# Altium project IOBoard2020.PrjPcb (part 1 of 3)
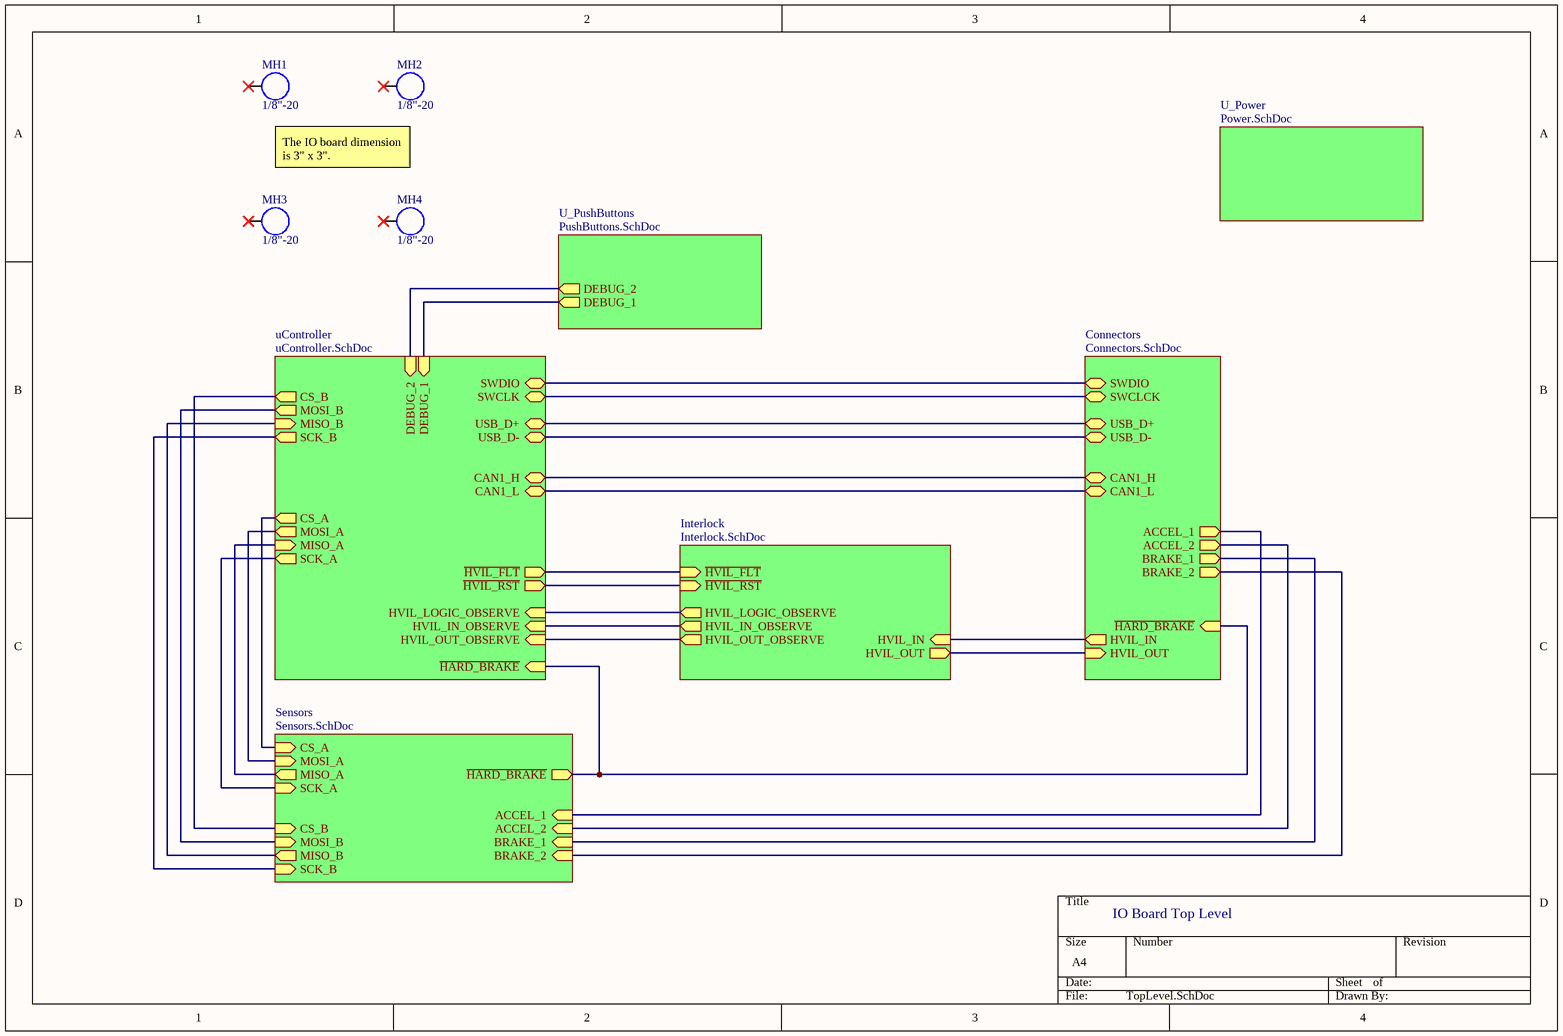
[diagram p0: TopLevel.SchDoc]
7 sheets, 153 parts. Net scope: hierarchical (ports join the sheet entries above them; power ports are global).
Board file: IOBoard2020.PcbDoc
Sheets:
  TopLevel.SchDoc
    uController = uController.SchDoc
    Connectors = Connectors.SchDoc
    Interlock = Interlock.SchDoc
    Sensors = Sensors.SchDoc
    U_Power = Power.SchDoc
    U_PushButtons = PushButtons.SchDoc

## Sheet TopLevel.SchDoc
size A4

### Parts
MH1  1/8"-20  [MOUNTING_HOLE]
MH2  1/8"-20  [MOUNTING_HOLE]
MH3  1/8"-20  [MOUNTING_HOLE]
MH4  1/8"-20  [MOUNTING_HOLE]

### Sub-sheets
Connectors = Connectors.SchDoc: CAN1_L (bidir), SWCLCK (bidir), SWDIO (bidir), USB_D+ (bidir), USB_D- (bidir), HVIL_IN (out), CAN1_H (bidir), HVIL_OUT (in), ACCEL_1 (out), BRAKE_1 (out), BRAKE_2 (out), ACCEL_2 (out), ~{HARD_BRAKE} (in)
Interlock = Interlock.SchDoc: HVIL_OUT_OBSERVE (out), HVIL_OUT (out), ~{HVIL_RST} (in), HVIL_IN (in), HVIL_IN_OBSERVE (out), ~{HVIL_FLT} (in), HVIL_LOGIC_OBSERVE (out)
Sensors = Sensors.SchDoc: ACCEL_2 (in), BRAKE_1 (in), BRAKE_2 (in), ACCEL_1 (in), ~{HARD_BRAKE} (out), MISO_A (out), MOSI_A (in), CS_A (in), SCK_A (in), MISO_B (out), MOSI_B (in), CS_B (in), SCK_B (in)
U_Power = Power.SchDoc: no entries
U_PushButtons = PushButtons.SchDoc: DEBUG_2 (out), DEBUG_1 (out)
uController = uController.SchDoc: HVIL_OUT_OBSERVE (in), HVIL_LOGIC_OBSERVE (in), HVIL_IN_OBSERVE (in), USB_D- (bidir), SWDIO (bidir), SWCLK (bidir), ~{HVIL_RST} (out), USB_D+ (bidir), ~{HVIL_FLT} (out), CAN1_H (bidir), CAN1_L (bidir), CS_B (out), MOSI_B (out), ~{HARD_BRAKE} (in), CS_A (out), MISO_A (in), SCK_A (out), MOSI_A (out), MISO_B (in), SCK_B (out), DEBUG_1 (in), DEBUG_2 (in)

### Nets
ACCEL_1: sheet Connectors/ACCEL_1, sheet Sensors/ACCEL_1
ACCEL_2: sheet Connectors/ACCEL_2, sheet Sensors/ACCEL_2
BRAKE_1: sheet Connectors/BRAKE_1, sheet Sensors/BRAKE_1
BRAKE_2: sheet Connectors/BRAKE_2, sheet Sensors/BRAKE_2
CAN1_N: sheet uController/CAN1_L, sheet Connectors/CAN1_L
CAN1_P: sheet uController/CAN1_H, sheet Connectors/CAN1_H
NetC42_2: sheet uController/DEBUG_1, sheet U_PushButtons/DEBUG_1
NetC43_2: sheet uController/DEBUG_2, sheet U_PushButtons/DEBUG_2
NetIC1_26: sheet uController/SCK_A, sheet Sensors/SCK_A
NetIC1_27: sheet uController/MISO_A, sheet Sensors/MISO_A
NetIC1_28: sheet uController/MOSI_A, sheet Sensors/MOSI_A
NetIC1_29: sheet uController/CS_A, sheet Sensors/CS_A
NetIC1_47: sheet uController/SCK_B, sheet Sensors/SCK_B
NetIC1_48: sheet uController/MISO_B, sheet Sensors/MISO_B
NetIC1_49: sheet uController/MOSI_B, sheet Sensors/MOSI_B
NetIC1_50: sheet uController/CS_B, sheet Sensors/CS_B
NetIC1_72: sheet uController/~{HARD_BRAKE}, sheet Connectors/~{HARD_BRAKE}, sheet Sensors/~{HARD_BRAKE}
NetIC1_73: sheet uController/USB_D-, sheet Connectors/USB_D-
NetIC1_74: sheet uController/USB_D+, sheet Connectors/USB_D+
NetIC1_75: sheet uController/SWDIO, sheet Connectors/SWDIO
NetIC1_79: sheet uController/SWCLK, sheet Connectors/SWCLCK
NetIC1_92: sheet uController/HVIL_LOGIC_OBSERVE, sheet Interlock/HVIL_LOGIC_OBSERVE
NetIC1_93: sheet uController/HVIL_IN_OBSERVE, sheet Interlock/HVIL_IN_OBSERVE
NetIC1_94: sheet uController/HVIL_OUT_OBSERVE, sheet Interlock/HVIL_OUT_OBSERVE
NetIC1_95: sheet uController/~{HVIL_FLT}, sheet Interlock/~{HVIL_FLT}
NetIC1_96: sheet uController/~{HVIL_RST}, sheet Interlock/~{HVIL_RST}
NetJ5_1: sheet Connectors/HVIL_OUT, sheet Interlock/HVIL_OUT
NetJ5_2: sheet Connectors/HVIL_IN, sheet Interlock/HVIL_IN

Not connected (* = marked no-connect by the designer): MH1 1*; MH2 1*; MH3 1*; MH4 1*

### Notes on the sheet
- The IO board dimension is 3" x 3".
- IO Board Top Level

### Library data of the parts
MH1-MH4 = Mounting Hole: Mounting Hole for 1/8"-20 Thread Size, 1-1/8" Long Black-Oxide Alloy Steel Socket Head Screw; Screw Specs: https://www.mcmaster.com/91251A560/

## Sheet uController.SchDoc
size A3
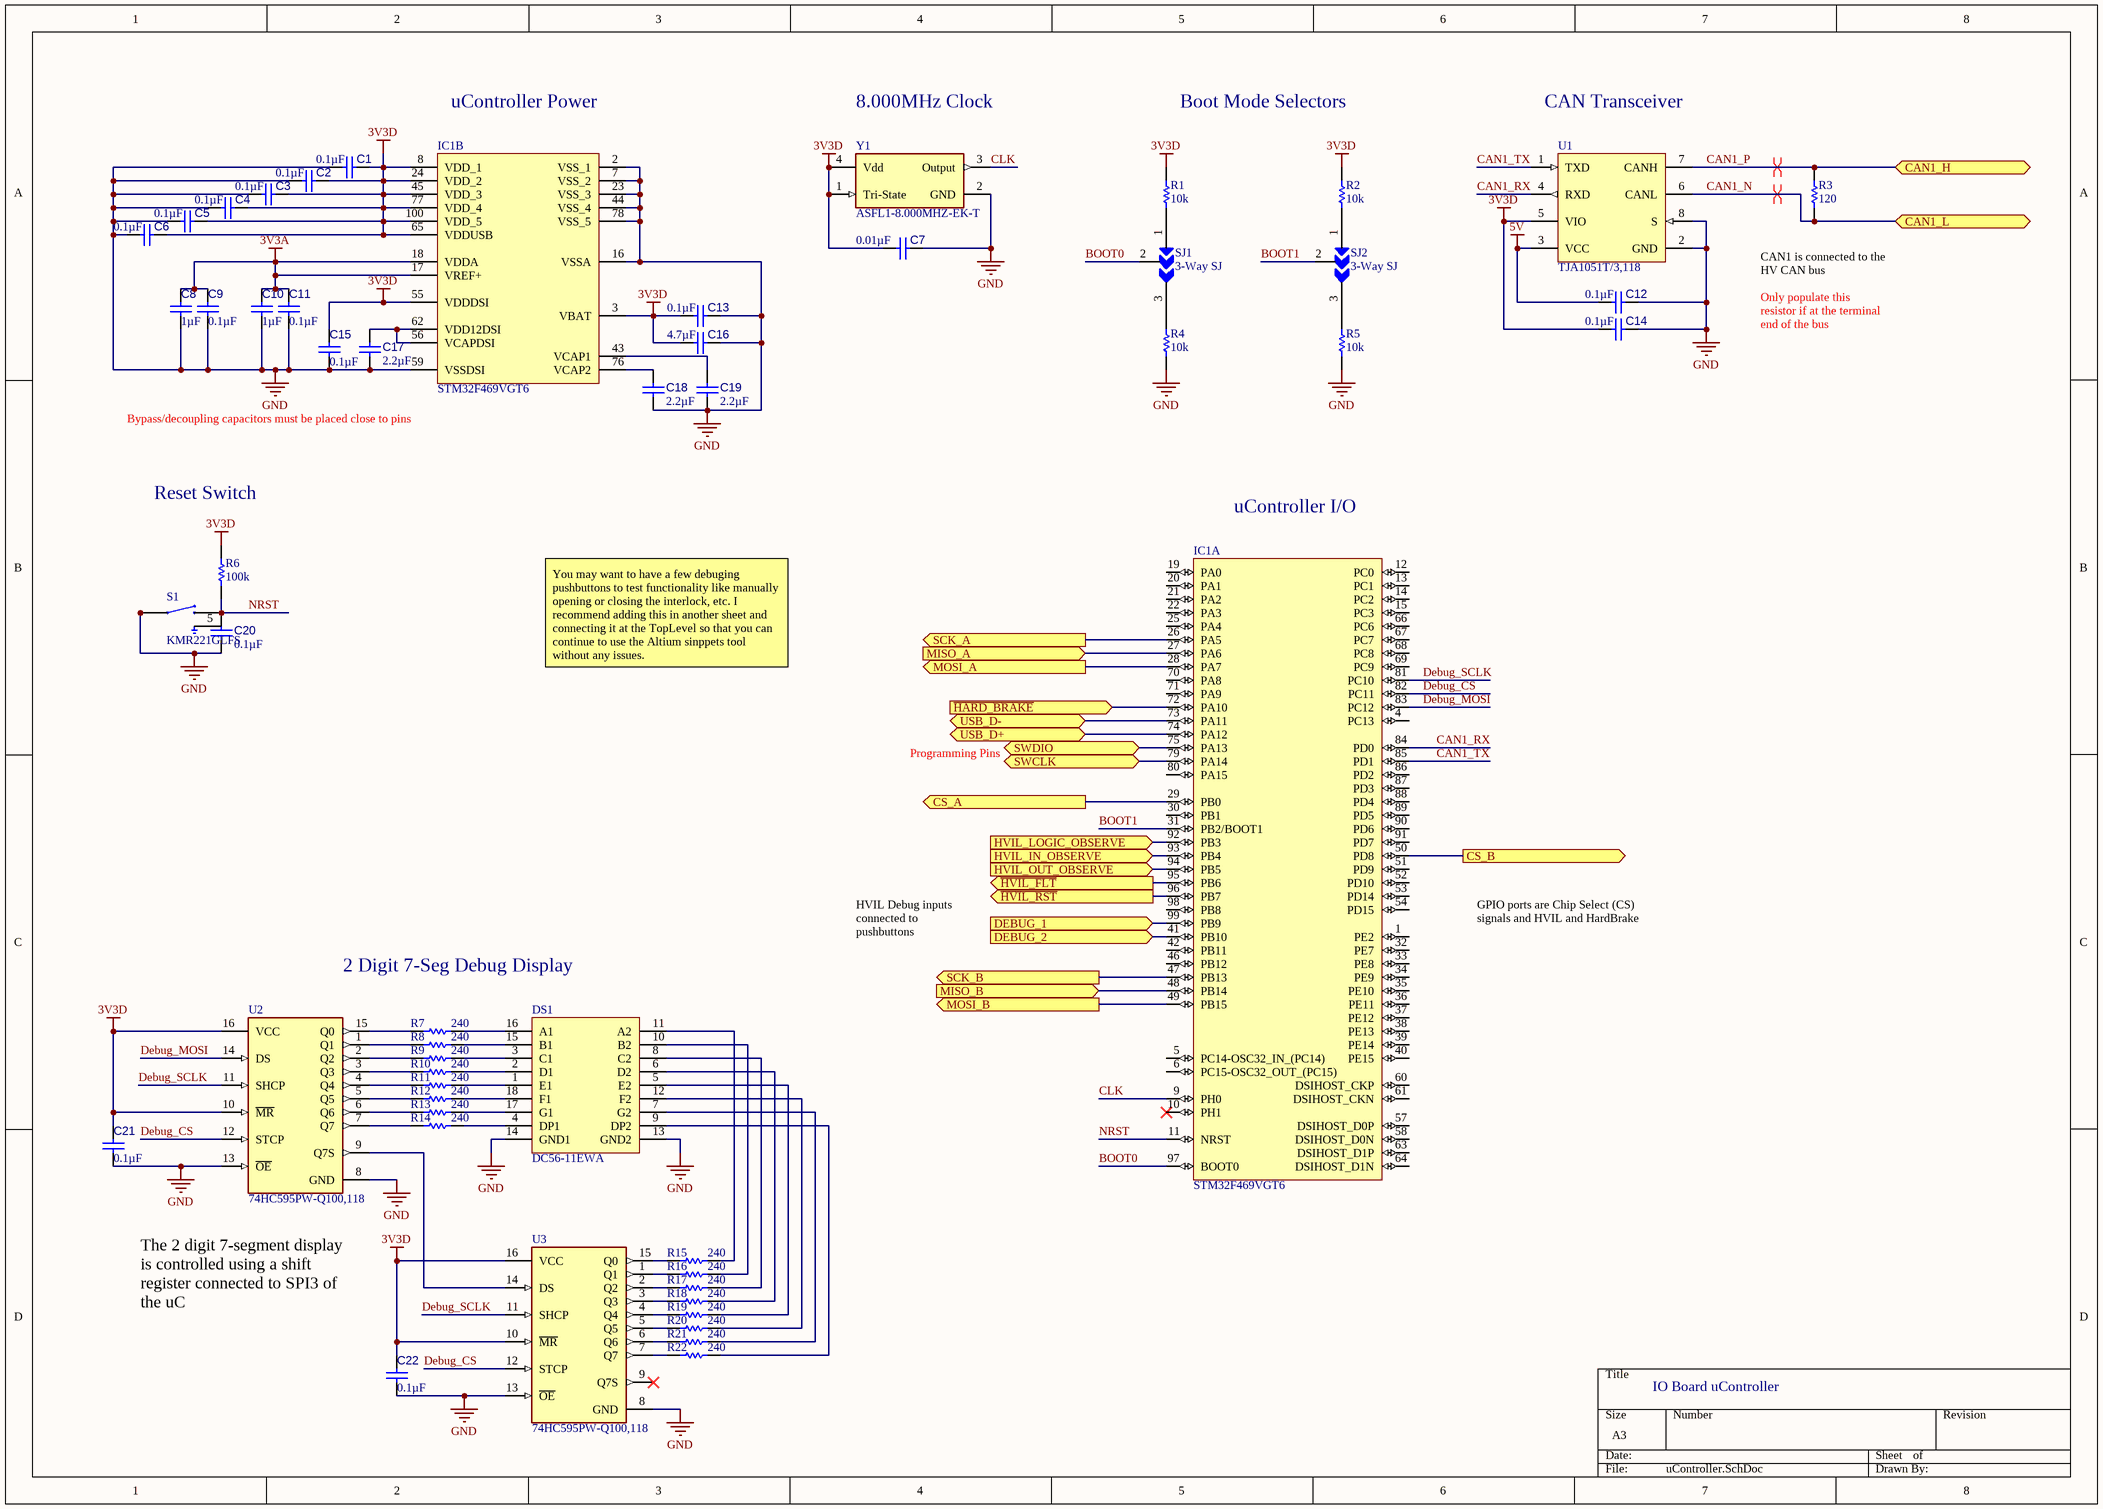
[diagram p1: uController.SchDoc]

### Parts
C1  0.1µF  [CAPC2013X145X50ML20T25]
C2  0.1µF  [CAPC2013X145X50ML20T25]
C3  0.1µF  [CAPC2013X145X50ML20T25]
C4  0.1µF  [CAPC2013X145X50ML20T25]
C5  0.1µF  [CAPC2013X145X50ML20T25]
C6  0.1µF  [CAPC2013X145X50ML20T25]
C7  0.01µF  [CAPC2013X145X50ML20T25]
C8  1µF  [CAPC2013X145X50ML20T25]
C9  0.1µF  [CAPC2013X145X50ML20T25]
C10  1µF  [CAPC2013X145X50ML20T25]
C11  0.1µF  [CAPC2013X145X50ML20T25]
C12  0.1µF  [CAPC2013X145X50ML20T25]
C13  0.1µF  [CAPC2013X145X50ML20T25]
C14  0.1µF  [CAPC2013X145X50ML20T25]
C15  0.1µF  [CAPC2013X145X50ML20T25]
C16  4.7µF  [CAPC2013X145X50ML20T25]
C17  2.2µF  [CAPC2013X145X50ML20T25]
C18  2.2µF  [CAPC2013X145X50ML20T25]
C19  2.2µF  [CAPC2013X145X50ML20T25]
C20  0.1µF  [CAPC2013X145X50ML20T25]
C21  0.1µF  [CAPC2013X145X50ML20T25]
C22  0.1µF  [CAPC2013X145X50ML20T25]
DS1  DC56-11EWA  [DIPS1524W75P254L2500H825Q18N]
IC1  STM32F469VGT6  [QFP50P1600X1600X160-100N]  (parts A,B of 2)
R1  10k  [RESC2013X50X35ML15T15]
R2  10k  [RESC2013X50X35ML15T15]
R3  120  [RESC2013X50X35ML15T15]
R4  10k  [RESC2013X50X35ML15T15]
R5  10k  [RESC2013X50X35ML15T15]
R6  100k  [RESC2013X50X35ML15T15]
R7  240  [RESC2013X50X35ML15T15]
R8  240  [RESC2013X50X35ML15T15]
R9  240  [RESC2013X50X35ML15T15]
R10  240  [RESC2013X50X35ML15T15]
R11  240  [RESC2013X50X35ML15T15]
R12  240  [RESC2013X50X35ML15T15]
R13  240  [RESC2013X50X35ML15T15]
R14  240  [RESC2013X50X35ML15T15]
R15  240  [RESC2013X50X35ML15T15]
R16  240  [RESC2013X50X35ML15T15]
R17  240  [RESC2013X50X35ML15T15]
R18  240  [RESC2013X50X35ML15T15]
R19  240  [RESC2013X50X35ML15T15]
R20  240  [RESC2013X50X35ML15T15]
R21  240  [RESC2013X50X35ML15T15]
R22  240  [RESC2013X50X35ML15T15]
S1  KMR221GLFS  [SW_KMR221GLFS]
SJ1  3-Way SJ  [3-Way SJ]
SJ2  3-Way SJ  [3-Way SJ]
U1  TJA1051T/3,118  [NXP-SOIC-8_L]
U2  74HC595PW-Q100,118  [FP-SOT403-1-MFG]
U3  74HC595PW-Q100,118  [FP-SOT403-1-MFG]
Y1  ASFL1-8.000MHZ-EK-T  [FP-ASFL1-MFG]

### Ports
CAN1_H (bidir), CAN1_L (bidir), CS_A (out), CS_B (out), DEBUG_1 (in), DEBUG_2 (in), HVIL_IN_OBSERVE (in), HVIL_LOGIC_OBSERVE (in), HVIL_OUT_OBSERVE (in), MISO_A (in), MISO_B (in), MOSI_A (out), MOSI_B (out), SCK_A (out), SCK_B (out), SWCLK (bidir), SWDIO (bidir), USB_D+ (bidir), USB_D- (bidir), ~{HARD_BRAKE} (in), ~{HVIL_FLT} (out), ~{HVIL_RST} (out)

### Nets
3V3A: C8.2 C9.1 C10.2 C11.1 IC1.17(VREF+) IC1.18(VDDA)
3V3D: C1.2 C2.2 C3.2 C4.2 C5.2 C6.2 C7.1 C13.1 C14.1 C15.1 C16.1 C21.1 C22.1 IC1.3(VBAT) IC1.8(VDD_1) IC1.24(VDD_2) IC1.45(VDD_3) IC1.55(VDDDSI) IC1.65(VDDUSB) IC1.77(VDD_4) IC1.100(VDD_5) R1.2 R2.2 R6.2 U1.5(VIO) U2.10(~{MR}) U2.16(VCC) U3.10(~{MR}) U3.16(VCC) Y1.1(Tri-State) Y1.4(Vdd)
5V: C12.1 U1.3(VCC)
GND: C1.1 C2.1 C3.1 C4.1 C5.1 C6.1 C7.2 C8.1 C9.2 C10.1 C11.2 C12.2 C13.2 C14.2 C15.2 C16.2 C17.1 C18.1 C19.1 C20.1 C21.2 C22.2 DS1.13(GND2) DS1.14(GND1) IC1.2(VSS_1) IC1.7(VSS_2) IC1.16(VSSA) IC1.23(VSS_3) IC1.44(VSS_4) IC1.59(VSSDSI) IC1.78(VSS_5) R4.1 R5.1 S1.1 S1.4 U1.2(GND) U1.8(S) U2.8(GND) U2.13(~{OE}) U3.8(GND) U3.13(~{OE}) Y1.2(GND)
BOOT0: IC1.97(BOOT0) SJ1.2
BOOT1: IC1.31(PB2/BOOT1) SJ2.2
CAN1_N: R3.1 U1.6(CANL) ; port CAN1_L
CAN1_P: R3.2 U1.7(CANH) ; port CAN1_H
CAN1_RX: IC1.84(PD0) U1.4(RXD)
CAN1_TX: IC1.85(PD1) U1.1(TXD)
CLK: IC1.9(PH0) Y1.3(Output)
Debug_CS: IC1.82(PC11) U2.12(STCP) U3.12(STCP)
Debug_MOSI: IC1.83(PC12) U2.14(DS)
Debug_SCLK: IC1.81(PC10) U2.11(SHCP) U3.11(SHCP)
NRST: C20.2 IC1.11(NRST) R6.1 S1.2 S1.3
NetC17_2: C17.2 IC1.56(VCAPDSI) IC1.62(VDD12DSI)
NetC18_2: C18.2 IC1.76(VCAP2)
NetC19_2: C19.2 IC1.43(VCAP1)
NetC42_2: IC1.99(PB9) ; port DEBUG_1
NetC43_2: IC1.41(PB10) ; port DEBUG_2
NetDS1_1: DS1.1(E1) R11.1
NetDS1_2: DS1.2(D1) R10.1
NetDS1_3: DS1.3(C1) R9.1
NetDS1_4: DS1.4(DP1) R14.1
NetDS1_5: DS1.5(E2) R19.1
NetDS1_6: DS1.6(D2) R18.1
NetDS1_7: DS1.7(G2) R21.1
NetDS1_8: DS1.8(C2) R17.1
NetDS1_9: DS1.9(DP2) R22.1
NetDS1_10: DS1.10(B2) R16.1
NetDS1_11: DS1.11(A2) R15.1
NetDS1_12: DS1.12(F2) R20.1
NetDS1_15: DS1.15(B1) R8.1
NetDS1_16: DS1.16(A1) R7.1
NetDS1_17: DS1.17(G1) R13.1
NetDS1_18: DS1.18(F1) R12.1
NetIC1_26: IC1.26(PA5) ; port SCK_A
NetIC1_27: IC1.27(PA6) ; port MISO_A
NetIC1_28: IC1.28(PA7) ; port MOSI_A
NetIC1_29: IC1.29(PB0) ; port CS_A
NetIC1_47: IC1.47(PB13) ; port SCK_B
NetIC1_48: IC1.48(PB14) ; port MISO_B
NetIC1_49: IC1.49(PB15) ; port MOSI_B
NetIC1_50: IC1.50(PD8) ; port CS_B
NetIC1_72: IC1.72(PA10) ; port ~{HARD_BRAKE}
NetIC1_73: IC1.73(PA11) ; port USB_D-
NetIC1_74: IC1.74(PA12) ; port USB_D+
NetIC1_75: IC1.75(PA13) ; port SWDIO
NetIC1_79: IC1.79(PA14) ; port SWCLK
NetIC1_92: IC1.92(PB3) ; port HVIL_LOGIC_OBSERVE
NetIC1_93: IC1.93(PB4) ; port HVIL_IN_OBSERVE
NetIC1_94: IC1.94(PB5) ; port HVIL_OUT_OBSERVE
NetIC1_95: IC1.95(PB6) ; port ~{HVIL_FLT}
NetIC1_96: IC1.96(PB7) ; port ~{HVIL_RST}
NetR1_1: R1.1 SJ1.1
NetR2_1: R2.1 SJ2.1
NetR4_2: R4.2 SJ1.3
NetR5_2: R5.2 SJ2.3
NetR7_2: R7.2 U2.15(Q0)
NetR8_2: R8.2 U2.1(Q1)
NetR9_2: R9.2 U2.2(Q2)
NetR10_2: R10.2 U2.3(Q3)
NetR11_2: R11.2 U2.4(Q4)
NetR12_2: R12.2 U2.5(Q5)
NetR13_2: R13.2 U2.6(Q6)
NetR14_2: R14.2 U2.7(Q7)
NetR15_2: R15.2 U3.15(Q0)
NetR16_2: R16.2 U3.1(Q1)
NetR17_2: R17.2 U3.2(Q2)
NetR18_2: R18.2 U3.3(Q3)
NetR19_2: R19.2 U3.4(Q4)
NetR20_2: R20.2 U3.5(Q5)
NetR21_2: R21.2 U3.6(Q6)
NetR22_2: R22.2 U3.7(Q7)
NetU2_9: U2.9(Q7S) U3.14(DS)

Not connected (* = marked no-connect by the designer): IC1 1(PE2) 4(PC13) 5(PC14-OSC32_IN_(PC14)) 6(PC15-OSC32_OUT_(PC15)) 10(PH1)* 12(PC0) 13(PC1) 14(PC2) 15(PC3) 19(PA0) 20(PA1) 21(PA2) 22(PA3) 25(PA4) 30(PB1) 32(PE7) 33(PE8) 34(PE9) 35(PE10) 36(PE11) 37(PE12) 38(PE13) 39(PE14) 40(PE15) 42(PB11) 46(PB12) 51(PD9) 52(PD10) 53(PD14) 54(PD15) 57(DSIHOST_D0P) 58(DSIHOST_D0N) 60(DSIHOST_CKP) 61(DSIHOST_CKN) 63(DSIHOST_D1P) 64(DSIHOST_D1N) 66(PC6) 67(PC7) 68(PC8) 69(PC9) 70(PA8) 71(PA9) 80(PA15) 86(PD2) 87(PD3) 88(PD4) 89(PD5) 90(PD6) 91(PD7) 98(PB8); S1 5; U3 9(Q7S)*

### Layout directives
differential pair: CAN1_N, CAN1_P

### Notes on the sheet
- uController Power
- 8.000MHz Clock
- Boot Mode Selectors
- CAN Transceiver
- (near R3) CAN1 is connected to the HV CAN bus
- Only populate this resistor if at the terminal end of the bus
- Bypass/decoupling capacitors must be placed close to pins
- Reset Switch
- uController I/O
- You may want to have a few debuging pushbuttons to test functionality like manually opening or closing the interlock, etc. I recommend adding this in another sheet and connecting it at the TopLevel so that you can continue to use the Altium sinppets tool without any issues.
- Programming Pins
- 2 Digit 7-Seg Debug Display
- HVIL Debug inputs connected to pushbuttons
- GPIO ports are Chip Select (CS) signals and HVIL and HardBrake
- The 2 digit 7-segment display is controlled using a shift register connected to SPI3 of the uC
- IO Board uController

### Library data of the parts
C1-C6 C9 C11-C15 C20-C22 = CMP-001-00010-4: Chip Capacitor, 0.1 uF, +/-10%, 25 V, 0805 (2012 Metric); Manufacturer: KEMET; Manufacturer Part Number: C0805C104K3RACTU; Dielectric Material: Ceramic; Tolerance: 10%; Capacitance: 100nF; Dielectric: X7R; Voltage: 25V; Value: 0.1µF; Supplier 1: Digi-Key; Supplier Part Number 1: 399-1168-1-ND; RoHS: Yes; Category: Ceramic Capacitors; Stock 1: 417116; Pricing 1: 1=0.14000, 10=0.10000, 50=0.05660, 100=0.04680, 500=0.03284, 1000=0.02719 (USD); Mount: Surface Mount; Case/Package: 0805; Min Operating Temperature: -55°C; Max Operating Temperature: 125°C; Packaging: Tape and Reel; Termination: SMD/SMT; Length: 2mm; Height: 0.9mm; Depth: 1.25mm; Radiation Hardening: No; ComponentLink1URL: https://datasheet.ciiva.com/18193/getdatasheetpartid-385649-18193413.pdf?src-supplier=Verical; ComponentLink1Description: https://datasheet.ciiva.com/18193/getdatasheetpartid-385649-18193413.pdf?src-supplier=Verical; ComponentLink2URL: https://datasheet.ciiva.com/7842/kem-c1002-x7r-smd-7842536.pdf?src-supplier=Element14; ComponentLink2Description: https://datasheet.ciiva.com/7842/kem-c1002-x7r-smd-7842536.pdf?src-supplier=Element14; ComponentLink3URL: https://datasheet.ciiva.com/7842/kem-c1002-x7r-smd-7842538.pdf?src-supplier=Element14; ComponentLink3Description: https://datasheet.ciiva.com/7842/kem-c1002-x7r-smd-7842538.pdf?src-supplier=Element14
C7 = CMP-001-00010-4: Chip Capacitor, 0.01 uF, +/-10%, 25 V, 0805 (2012 Metric); Manufacturer: KEMET; Manufacturer Part Number: C0805C103K3RACTU; Dielectric Material: Ceramic; Capacitance: 10nF; Voltage Rating: 25V; Tolerance: 10%; Dielectric: X7R; Dissipation Factor: 3.5%; Value: 0.01µF; Supplier 1: Digi-Key; Supplier Part Number 1: 399-7994-1-ND; RoHS: Yes; Category: Ceramic Capacitors; Stock 1: 50651; Pricing 1: 1=0.15000, 10=0.11000, 50=0.06220, 100=0.05160, 500=0.03616, 1000=0.02994 (USD); Mount: Surface Mount; Case/Package: 0805; Case Code (Metric): 2012; Case Code (Imperial): 0805; Min Operating Temperature: -55°C; Max Operating Temperature: 125°C; Package Quantity: 1; Packaging: Tape and Reel; Voltage Rating (DC): 25V; Termination: SMD/SMT; Length: 2mm; Height: 0.78mm; Lead Pitch: 0.75mm; Width: 0.049inch; Thickness: 0.035inch; Depth: 1.25mm; Radiation Hardening: No; REACH SVHC: No SVHC; ComponentLink1URL: http://www.jameco.com/Jameco/Products/ProdDS/1637716.pdf?src-supplier=Jameco; ComponentLink1Description: http://www.jameco.com/Jameco/Products/ProdDS/1637716.pdf?src-supplier=Jameco; ComponentLink2URL: http://www.farnell.com/datasheets/2746089.pdf?src-supplier=Farnell; ComponentLink2Description: http://www.farnell.com/datasheets/2746089.pdf?src-supplier=Farnell; ComponentLink3URL: https://www.verical.com/server-webapp/html/getDatasheet?partID=697850&src-supplier=Verical; ComponentLink3Description: https://www.verical.com/server-webapp/html/getDatasheet?partID=697850&src-supplier=Verical; ComponentLink4URL: http://components.arrow.com/part/dataview/0323_00325063?src-supplier=Arrow+Europe; ComponentLink4Description: http://components.arrow.com/part/dataview/0323_00325063?src-supplier=Arrow+Europe; ComponentLink5URL: http://www.farnell.com/datasheets/2315422.pdf?src-supplier=Farnell; ComponentLink5Description: http://www.farnell.com/datasheets/2315422.pdf?src-supplier=Farnell; ComponentLink6URL: http://www.mouser.com/ds/2/212/KEM_C1002_X7R_SMD-1102033.pdf?src-supplier=Mouser; ComponentLink6Description: http://www.mouser.com/ds/2/212/KEM_C1002_X7R_SMD-1102033.pdf?src-supplier=Mouser; ComponentLink7URL: http://components.arrow.com/part/dataview/2091057S98063N7429?src-supplier=Arrow+Electronics; ComponentLink7Description: http://components.arrow.com/part/dataview/2091057S98063N7429?src-supplier=Arrow+Electronics; ComponentLink8URL: https://api.kemet.com/component-edge/download/datasheet/C0805C103K3RACTU.pdf?src-supplier=Digi-Key; ComponentLink8Description: https://api.kemet.com/component-edge/download/datasheet/C0805C103K3RACTU.pdf?src-supplier=Digi-Key; ComponentLink9URL: http://capacitoredge.kemet.com/capedge2/DataSheet?pn=C0805C103K3RACTU&src-supplier=Avnet; ComponentLink9Description: http://capacitoredge.kemet.com/capedge2/DataSheet?pn=C0805C103K3RACTU&src-supplier=Avnet; ComponentLink10URL: https://search.kemet.com/component-edge/download/datasheet/C0805C103K3RACTU.pdf?src-supplier=Digi-Key; ComponentLink10Description: https://search.kemet.com/component-edge/download/datasheet/C0805C103K3RACTU.pdf?src-supplier=Digi-Key; ComponentLink11URL: http://www.farnell.com/datasheets/2746089.pdf?src-supplier=Newark; ComponentLink11Description: http://www.farnell.com/datasheets/2746089.pdf?src-supplier=Newark; ComponentLink12URL: http://www.farnell.com/datasheets/2064982.pdf?src-supplier=Element14; ComponentLink12Description: http://www.farnell.com/datasheets/2064982.pdf?src-supplier=Element14
C8 C10 = CMP-001-00010-4: Chip Capacitor, 1 uF, +/-10%, 25 V, 0805 (2012 Metric); Manufacturer: KEMET; Manufacturer Part Number: C0805C105K3RACTU; Dielectric Material: Ceramic; Capacitance: 1uF; Tolerance: 10%; Dielectric: X7R; Voltage: 25V; Value: 1µF; Supplier 1: Digi-Key; Supplier Part Number 1: 399-8004-1-ND; RoHS: Yes; Category: Ceramic Capacitors; Stock 1: 360844; Pricing 1: 1=0.14000, 10=0.10100, 50=0.05720, 100=0.04740, 500=0.03322, 1000=0.02750 (USD); Mount: Surface Mount; Case/Package: 0805; Number of Pins: 2; Contact Plating: Tin,Matte; Case Code (Imperial): 0805; Case Code (Metric): 2012; Min Operating Temperature: -55°C; Max Operating Temperature: 125°C; Packaging: Tape and Reel; Termination: SMD/SMT; Package Quantity: 1; Voltage Rating: 25V; Voltage Rating (DC): 25V; Length: 2mm; Height: 1.25mm; Depth: 1.25mm; Width: 0.049inch; Thickness: 0.055inch; Radiation Hardening: No; REACH SVHC: No SVHC; ComponentLink1URL: https://datasheet.ciiva.com/6074/kem-c1002-x7r-smd-6074661.pdf?src-supplier=Farnell; ComponentLink1Description: https://datasheet.ciiva.com/6074/kem-c1002-x7r-smd-6074661.pdf?src-supplier=Farnell; ComponentLink2URL: https://datasheet.ciiva.com/28610/1918693-28610874.pdf?src-supplier=Element14; ComponentLink2Description: https://datasheet.ciiva.com/28610/1918693-28610874.pdf?src-supplier=Element14
C16 = CMP-001-00010-4: Chip Capacitor, 4.7 uF, +/-10%, 25 V, 0805 (2012 Metric); Manufacturer: KEMET; Manufacturer Part Number: C0805C475K3PACTU; Dielectric Material: Ceramic; Capacitance: 4.7uF; Tolerance: 10%; Dielectric: X5R; Voltage: 25V; Value: 4.7µF; Supplier 1: Digi-Key; Supplier Part Number 1: 399-5505-1-ND; RoHS: Yes; Category: Ceramic Capacitors; Stock 1: 643803; Pricing 1: 1=0.33000, 10=0.22700, 50=0.15880, 100=0.13610, 500=0.10210, 1000=0.08621 (USD); Mount: Surface Mount; Case/Package: 0805; Number of Pins: 2; Min Operating Temperature: -55°C; Max Operating Temperature: 85°C; Packaging: Tape and Reel; Termination: SMD/SMT; Voltage Rating (DC): 25V; Length: 2mm; Height: 1.25mm; Depth: 1.25mm; Radiation Hardening: No; Lead Free: Lead Free; ComponentLink1URL: https://datasheet.ciiva.com/22748/1918694-22748309.pdf?src-supplier=Element14; ComponentLink1Description: https://datasheet.ciiva.com/22748/1918694-22748309.pdf?src-supplier=Element14; ComponentLink2URL: https://datasheet.ciiva.com/7842/40889-7842614.pdf?src-supplier=Element14; ComponentLink2Description: https://datasheet.ciiva.com/7842/40889-7842614.pdf?src-supplier=Element14; ComponentLink3URL: https://datasheet.ciiva.com/18193/getdatasheetpartid-385757-18193895.pdf?src-supplier=Verical; ComponentLink3Description: https://datasheet.ciiva.com/18193/getdatasheetpartid-385757-18193895.pdf?src-supplier=Verical; ComponentLink4URL: https://datasheet.ciiva.com/18193/getdatasheetpartid-195812-18193898.pdf?src-supplier=Verical; ComponentLink4Description: https://datasheet.ciiva.com/18193/getdatasheetpartid-195812-18193898.pdf?src-supplier=Verical
C17-C19 = CMP-001-00010-4: Chip Capacitor, 2.2 uF, +/-10%, 25 V, 0805 (2012 Metric); Manufacturer: KEMET; Manufacturer Part Number: C0805C225K3RACTU; Dielectric Material: Ceramic; Capacitance: 2.2uF; Tolerance: 10%; Dielectric: X7R; Voltage Rating (DC): 25V; Value: 2.2µF; Supplier 1: Digi-Key; Supplier Part Number 1: 399-11941-1-ND; RoHS: Yes; Category: Ceramic Capacitors; Stock 1: 55952; Pricing 1: 1=0.28000, 10=0.19300, 50=0.11600, 100=0.09790, 500=0.06700, 1000=0.05928 (USD); Mount: Surface Mount; Case/Package: 0805; Case Code (Imperial): 0805; Case Code (Metric): 2012; Min Operating Temperature: -55°C; Max Operating Temperature: 125°C; Packaging: Cut Tape; Voltage: 25V; Termination: Solder; Dissipation Factor: 10%; Voltage Rating: 25V; Length: 0.079inch; Height: 1.25mm; Depth: 1.25mm; Width: 0.049inch; Thickness: 0.055inch; REACH SVHC: No SVHC; ComponentLink1URL: http://www.mouser.com/ds/2/212/KEM_C1002_X7R_SMD-1102033.pdf?src-supplier=Mouser; ComponentLink1Description: http://www.mouser.com/ds/2/212/KEM_C1002_X7R_SMD-1102033.pdf?src-supplier=Mouser; ComponentLink2URL: http://www.farnell.com/datasheets/2741187.pdf?src-supplier=Farnell; ComponentLink2Description: http://www.farnell.com/datasheets/2741187.pdf?src-supplier=Farnell; ComponentLink3URL: http://www.alliedelec.com/m/d/51f554c3dd800f51434b811e71a34895.pdf?src-supplier=Allied+Electronics; ComponentLink3Description: http://www.alliedelec.com/m/d/51f554c3dd800f51434b811e71a34895.pdf?src-supplier=Allied+Electronics; ComponentLink4URL: http://www.kemet.com/docfinder?Partnumber=C0805C225K3RAC7800&src-supplier=Digi-Key; ComponentLink4Description: http://www.kemet.com/docfinder?Partnumber=C0805C225K3RAC7800&src-supplier=Digi-Key; ComponentLink5URL: http://www.kemet.com/Lists/ProductCatalog/Attachments/53/KEM_C1002_X7R_SMD.pdf?src-supplier=Avnet; ComponentLink5Description: http://www.kemet.com/Lists/ProductCatalog/Attachments/53/KEM_C1002_X7R_SMD.pdf?src-supplier=Avnet; ComponentLink6URL: https://api.kemet.com/component-edge/download/datasheet/C0805C225K3RAC7800.pdf?src-supplier=Digi-Key; ComponentLink6Description: https://api.kemet.com/component-edge/download/datasheet/C0805C225K3RAC7800.pdf?src-supplier=Digi-Key; ComponentLink7URL: http://www.farnell.com/datasheets/2112056.pdf?src-supplier=Element14; ComponentLink7Description: http://www.farnell.com/datasheets/2112056.pdf?src-supplier=Element14; ComponentLink8URL: http://www.farnell.com/datasheets/2741187.pdf?src-supplier=Newark; ComponentLink8Description: http://www.farnell.com/datasheets/2741187.pdf?src-supplier=Newark
DS1 = DC56-11EWA: Display; Manufacturer_Name: Kingbright; Datasheet Link: http://www.us.kingbright.com/images/catalog/SPEC/DC56-11EWA.pdf; Height: 8.25mm; Manufacturer_Part_Number: DC56-11EWA; Arrow Part Number: DC56-11EWA; Arrow Price/Stock: https://www.arrow.com/en/products/dc56-11ewa/kingbright; Mouser Part Number: 604-DC56-11EWA; Mouser Price/Stock: https://www.mouser.co.uk/ProductDetail/Kingbright/DC56-11EWA?qs=SO8VdE%2FgosGvL%2FnJcFkMow%3D%3D
IC1 = STM32F469VGT6: Integrated Circuit; Manufacturer_Name: STMicroelectronics; Datasheet Link: http://www.mouser.com/datasheet/2/389/stm32f469ae-956306.pdf; Height: 1.6mm; Manufacturer_Part_Number: STM32F469VGT6; Arrow Part Number: STM32F469VGT6; Arrow Price/Stock: https://www.arrow.com/en/products/stm32f469vgt6/stmicroelectronics; Mouser Part Number: 511-STM32F469VGT6; Mouser Price/Stock: https://www.mouser.co.uk/ProductDetail/STMicroelectronics/STM32F469VGT6?qs=o7IDWEFmXKBnYVpbRx%2F38g%3D%3D
R1 R2 R4 R5 = CMP-009-00001-4: Chip Resistor, 10k Ohm, +/- 1%, 125 mW, -55 to 155 degC, 0805 (2012 Metric); Manufacturer: Yageo; Manufacturer Part Number: RC0805FR-0710KL; Resistance: 10kR; Temperature Coefficient: 100ppm/°C; Power Rating: 125mW; Voltage Rating: 150V; Value: 10k; Supplier 1: Digi-Key; Supplier Part Number 1: 311-10.0KCRCT-ND; RoHS: Yes; Category: Chip SMD Resistors; Stock 1: 19063106; Pricing 1: 1=0.10000, 10=0.03900, 100=0.01570, 1000=0.00705, 2500=0.00612 (USD); Case/Package: 0805; Case Code (Imperial): 0805; Case Code (Metric): 2012; Min Operating Temperature: -55°C; Max Operating Temperature: 155°C; Packaging: Tape and Reel; Tolerance: 1%; Composition: Thick Film; Package Quantity: 1; Termination: SMD/SMT; Number of Terminations: 2; Military Standard: Not; Max Power Dissipation: 125mW; Features: Moisture Resistant; Length: 2mm; Height: 0.024inch; Width: 0.049inch; Depth: 1.25mm; REACH SVHC: Unknown; Lead Free: Lead Free; ComponentLink1URL: https://datasheet.ciiva.com/11808/0900766b8106beab-11808151.pdf?src-supplier=RSComponents; ComponentLink1Description: https://datasheet.ciiva.com/11808/0900766b8106beab-11808151.pdf?src-supplier=RSComponents; ComponentLink2URL: https://datasheet.ciiva.com/12669/rc0805-12669688.pdf?src-supplier=Mouser; ComponentLink2Description: https://datasheet.ciiva.com/12669/rc0805-12669688.pdf?src-supplier=Mouser; ComponentLink3URL: https://datasheet.ciiva.com/46447/444164-46447563.pdf?src-supplier=Element14; ComponentLink3Description: https://datasheet.ciiva.com/46447/444164-46447563.pdf?src-supplier=Element14; ComponentLink4URL: https://datasheet.ciiva.com/2456/pyu-r-int-thick-7-2456972.pdf?src-supplier=Digi-Key; ComponentLink4Description: https://datasheet.ciiva.com/2456/pyu-r-int-thick-7-2456972.pdf?src-supplier=Digi-Key; ComponentLink5URL: https://datasheet.ciiva.com/2456/pyu-r-int-thick-7-2456973.pdf?src-supplier=Digi-Key; ComponentLink5Description: https://datasheet.ciiva.com/2456/pyu-r-int-thick-7-2456973.pdf?src-supplier=Digi-Key; ComponentLink6URL: https://datasheet.ciiva.com/2456/pyu-r-int-thick-7-2456974.pdf?src-supplier=Digi-Key; ComponentLink6Description: https://datasheet.ciiva.com/2456/pyu-r-int-thick-7-2456974.pdf?src-supplier=Digi-Key; ComponentLink7URL: https://datasheet.ciiva.com/16747/rc0805-16747087.pdf?src-supplier=Future+Electronics; ComponentLink7Description: https://datasheet.ciiva.com/16747/rc0805-16747087.pdf?src-supplier=Future+Electronics
R3 = CMP-009-00001-4: Chip Resistor, 120 Ohm, +/- 1%, 125 mW, -55 to 155 degC, 0805 (2012 Metric); Manufacturer: TE Connectivity; Manufacturer Part Number: CRGCQ0805F120R; Resistance: 120R; Max Power Dissipation: 125mW; Temperature Coefficient: 100ppm/°C; Value: 120; Supplier 1: Digi-Key; Supplier Part Number 1: A129738CT-ND; Stock 1: 52253; Pricing 1: 1=0.10000, 10=0.04700, 100=0.01890, 1000=0.00851, 2500=0.00738 (USD); Case/Package: 0805; Case Code (Imperial): 0805; Case Code (Metric): 2012; Min Operating Temperature: -55°C; Max Operating Temperature: 155°C; Composition: Thick Film; Features: Moisture Resistant; Packaging: Tape and Reel; Tolerance: 1%; Number of Terminations: 2; ComponentLink1URL: https://www.te.com/commerce/DocumentDelivery/DDEController?Action=srchrtrv&amp;DocNm=1773204-3&amp;DocType=DS&amp;DocLang=English&src-supplier=Digi-Key; ComponentLink1Description: https://www.te.com/commerce/DocumentDelivery/DDEController?Action=srchrtrv&amp;DocNm=1773204-3&amp;DocType=DS&amp;DocLang=English&src-supplier=Digi-Key; ComponentLink2URL: https://4donline.ihs.com/images/VipMasterIC/IC/TYEL/TYEL-S-A0004929575/TYEL-S-A0004929575-1.pdf?hkey=52A5661711E402568146F3353EA87419&src-supplier=Element14; ComponentLink2Description: https://4donline.ihs.com/images/VipMasterIC/IC/TYEL/TYEL-S-A0004929575/TYEL-S-A0004929575-1.pdf?hkey=52A5661711E402568146F3353EA87419&src-supplier=Element14; ComponentLink3URL: https://4donline.ihs.com/images/VipMasterIC/IC/TYEL/TYEL-S-A0004929575/TYEL-S-A0004929575-1.pdf?hkey=52A5661711E402568146F3353EA87419&src-supplier=Newark; ComponentLink3Description: https://4donline.ihs.com/images/VipMasterIC/IC/TYEL/TYEL-S-A0004929575/TYEL-S-A0004929575-1.pdf?hkey=52A5661711E402568146F3353EA87419&src-supplier=Newark; ComponentLink4URL: https://4donline.ihs.com/images/VipMasterIC/IC/TYEL/TYEL-S-A0004929575/TYEL-S-A0004929575-1.pdf?hkey=52A5661711E402568146F3353EA87419&src-supplier=Farnell; ComponentLink4Description: https://4donline.ihs.com/images/VipMasterIC/IC/TYEL/TYEL-S-A0004929575/TYEL-S-A0004929575-1.pdf?hkey=52A5661711E402568146F3353EA87419&src-supplier=Farnell; ComponentLink5URL: http://datasheet.octopart.com/CRGCQ0805F120R-TE-Connectivity-datasheet-114679081.pdf?src-supplier=Master+Electronics; ComponentLink5Description: http://datasheet.octopart.com/CRGCQ0805F120R-TE-Connectivity-datasheet-114679081.pdf?src-supplier=Master+Electronics; ComponentLink6URL: http://sigma.octopart.com/114695583/technical_drawing/TE-Connectivity-CRGCQ0805F120R.pdf?src-supplier=Sager+Electronics; ComponentLink6Description: http://sigma.octopart.com/114695583/technical_drawing/TE-Connectivity-CRGCQ0805F120R.pdf?src-supplier=Sager+Electronics
R6 = CMP-009-00001-4: Chip Resistor, 100k Ohm, +/- 1%, 125 mW, -55 to 155 degC, 0805 (2012 Metric); Manufacturer: Yageo; Manufacturer Part Number: RC0805FR-07100KL; Resistance: 100kR; Voltage Rating (DC): 150V; Temperature Coefficient: 100ppm/°C; Power Rating: 125mW; Value: 100k; Supplier 1: Digi-Key; Supplier Part Number 1: 311-100KCRCT-ND; RoHS: Yes; Category: Chip SMD Resistors; Stock 1: 3716407; Pricing 1: 1=0.10000, 10=0.03900, 100=0.01570, 1000=0.00705, 2500=0.00612 (USD); Case/Package: 0805; Number of Pins: 2; Case Code (Metric): 2012; Case Code (Imperial): 0805; Min Operating Temperature: -55°C; Max Operating Temperature: 155°C; Tolerance: 1%; Packaging: Tape and Reel; Composition: Thick Film; Voltage Rating: 150V; Package Quantity: 1; Number of Terminations: 2; Termination: SMD/SMT; Military Standard: Not; Max Power Dissipation: 125mW; Features: Moisture Resistant; Length: 2mm; Height: 0.024inch; Width: 0.049inch; Depth: 1.25mm; Lead Pitch: 0.4mm; REACH SVHC: Unknown; Lead Free: Lead Free; ComponentLink1URL: https://datasheet.ciiva.com/11808/0900766b8106beab-11808858.pdf?src-supplier=RSComponents; ComponentLink1Description: https://datasheet.ciiva.com/11808/0900766b8106beab-11808858.pdf?src-supplier=RSComponents; ComponentLink2URL: https://datasheet.ciiva.com/2457/pyu-r-int-thick-7-2457017.pdf?src-supplier=Digi-Key; ComponentLink2Description: https://datasheet.ciiva.com/2457/pyu-r-int-thick-7-2457017.pdf?src-supplier=Digi-Key; ComponentLink3URL: https://datasheet.ciiva.com/12667/rc0805-12667001.pdf?src-supplier=Mouser; ComponentLink3Description: https://datasheet.ciiva.com/12667/rc0805-12667001.pdf?src-supplier=Mouser; ComponentLink4URL: https://datasheet.ciiva.com/2457/pyu-r-int-thick-7-2457018.pdf?src-supplier=Digi-Key; ComponentLink4Description: https://datasheet.ciiva.com/2457/pyu-r-int-thick-7-2457018.pdf?src-supplier=Digi-Key; ComponentLink5URL: https://datasheet.ciiva.com/16747/rc0805-16747226.pdf?src-supplier=Future+Electronics; ComponentLink5Description: https://datasheet.ciiva.com/16747/rc0805-16747226.pdf?src-supplier=Future+Electronics; ComponentLink6URL: https://datasheet.ciiva.com/2457/pyu-r-int-thick-7-2457019.pdf?src-supplier=Digi-Key; ComponentLink6Description: https://datasheet.ciiva.com/2457/pyu-r-int-thick-7-2457019.pdf?src-supplier=Digi-Key; ComponentLink7URL: https://datasheet.ciiva.com/7660/38627-7660796.pdf?src-supplier=Element14; ComponentLink7Description: https://datasheet.ciiva.com/7660/38627-7660796.pdf?src-supplier=Element14; ComponentLink8URL: https://datasheet.ciiva.com/7941/1697719-7941676.pdf?src-supplier=Element14; ComponentLink8Description: https://datasheet.ciiva.com/7941/1697719-7941676.pdf?src-supplier=Element14; ComponentLink9URL: https://datasheet.ciiva.com/7941/1686128-7941677.pdf?src-supplier=Element14; ComponentLink9Description: https://datasheet.ciiva.com/7941/1686128-7941677.pdf?src-supplier=Element14; ComponentLink10URL: https://datasheet.ciiva.com/7941/1697719-7941678.pdf?src-supplier=Element14; ComponentLink10Description: https://datasheet.ciiva.com/7941/1697719-7941678.pdf?src-supplier=Element14; ComponentLink11URL: https://datasheet.ciiva.com/22747/444164-22747534.pdf?src-supplier=Element14; ComponentLink11Description: https://datasheet.ciiva.com/22747/444164-22747534.pdf?src-supplier=Element14
R7-R22 = CMP-009-00001-4: Chip Resistor, 240 Ohm, +/- 1%, 125 mW, -55 to 155 degC, 0805 (2012 Metric); Manufacturer: Panasonic; Manufacturer Part Number: ERA-6AEB241V; Resistance: 240R; Power Rating: 125mW; Tolerance: 0.1%; Voltage Rating: 100V; Temperature Coefficient: 25ppm/°C; Value: 240; Supplier 1: Digi-Key; Supplier Part Number 1: P240DACT-ND; RoHS: Yes; Category: Chip SMD Resistors; Stock 1: 12724; Pricing 1: 1=0.33000, 10=0.27800, 100=0.10850, 1000=0.04541, 2500=0.04163 (USD); Mount: Surface Mount; Case/Package: 0805; Number of Pins: 2; Case Code (Metric): 2012; Case Code (Imperial): 0805; Contact Plating: Tin; Min Operating Temperature: -55°C; Max Operating Temperature: 155°C; Packaging: Tape and Reel; Package Quantity: 1; Composition: Thin Film; Number of Terminations: 2; Military Standard: Not; Termination: Solder; Max Power Dissipation: 125mW; Voltage Rating (DC): 100V; Features: Automotive AEC-Q200; Length: 2mm; Height: 0.5mm; Width: 1.25mm; Depth: 1.25mm; Radiation Hardening: No; REACH SVHC: No SVHC; Lead Free: Lead Free; ComponentLink1URL: https://datasheet.ciiva.com/29184/452815-da-01-en-widerstand-0805-era-29184072.pdf?src-supplier=Conrad; ComponentLink1Description: https://datasheet.ciiva.com/29184/452815-da-01-en-widerstand-0805-era-29184072.pdf?src-supplier=Conrad; ComponentLink2URL: https://datasheet.ciiva.com/5915/485442-5915205.pdf?src-supplier=Farnell; ComponentLink2Description: https://datasheet.ciiva.com/5915/485442-5915205.pdf?src-supplier=Farnell; ComponentLink3URL: https://datasheet.ciiva.com/43455/485442-43455397.pdf?src-supplier=Farnell; ComponentLink3Description: https://datasheet.ciiva.com/43455/485442-43455397.pdf?src-supplier=Farnell; ComponentLink4URL: https://datasheet.ciiva.com/30154/54aoa0000ce26-30154486.pdf?src-supplier=Onlinecomponents.com; ComponentLink4Description: https://datasheet.ciiva.com/30154/54aoa0000ce26-30154486.pdf?src-supplier=Onlinecomponents.com; ComponentLink5URL: https://datasheet.ciiva.com/48425/era-eng-tds-48425782.pdf?src-supplier=Distrelec; ComponentLink5Description: https://datasheet.ciiva.com/48425/era-eng-tds-48425782.pdf?src-supplier=Distrelec; ComponentLink6URL: https://datasheet.ciiva.com/5915/485442-5915208.pdf?src-supplier=Farnell; ComponentLink6Description: https://datasheet.ciiva.com/5915/485442-5915208.pdf?src-supplier=Farnell; ComponentLink7URL: https://datasheet.ciiva.com/46389/485442-46389960.pdf?src-supplier=Element14; ComponentLink7Description: https://datasheet.ciiva.com/46389/485442-46389960.pdf?src-supplier=Element14; ComponentLink8URL: https://datasheet.ciiva.com/46389/485442-46389961.pdf?src-supplier=Element14; ComponentLink8Description: https://datasheet.ciiva.com/46389/485442-46389961.pdf?src-supplier=Element14; ComponentLink9URL: https://datasheet.ciiva.com/48536/era-eng-tds-48536634.pdf?src-supplier=Distrelec; ComponentLink9Description: https://datasheet.ciiva.com/48536/era-eng-tds-48536634.pdf?src-supplier=Distrelec; ComponentLink10URL: https://datasheet.ciiva.com/22739/485442-22739483.pdf?src-supplier=Element14; ComponentLink10Description: https://datasheet.ciiva.com/22739/485442-22739483.pdf?src-supplier=Element14; ComponentLink11URL: https://datasheet.ciiva.com/17206/aoa0000ce26-17206700.pdf?src-supplier=Avnet+Europe; ComponentLink11Description: https://datasheet.ciiva.com/17206/aoa0000ce26-17206700.pdf?src-supplier=Avnet+Europe; ComponentLink12URL: https://datasheet.ciiva.com/43457/485442-43457869.pdf?src-supplier=Farnell; ComponentLink12Description: https://datasheet.ciiva.com/43457/485442-43457869.pdf?src-supplier=Farnell
S1 = KMR221GLFS: Tactile Switch SPST-NO Top Actuated Surface Mount; MF: C&K; MP: KMR221GLFS; Price: None; Package: None; Value: *; Availability: Unavailable; SnapEDA_Link: https://www.snapeda.com/parts/KMR221GLFS/C%26K/view-part/347724/?ref=snap
SJ1 SJ2 = 3-Way SJ: 3-Way Solder Jumper
U1 = CMP-2000-07245-1: High-Speed CAN Transceiver, 3 to 5 V, 8-Pin SOIC (SOT96-1), RoHS, Tape and Reel; Manufacturer: NXP; Power Down Mode: Normal/Silent; Rad Hardened: No; Number of Transceivers: 1; Supply Current: 70mA; Operating Supply Voltage (Max): 5.5V; Operating Supply Voltage (Typ): 5V; Operating Supply Voltage (Min): 4.5V; Standard Supported: ISO11898-2; Data Rate: 1Mbps; DELETED: Compliant; Operating Temperature (Min): -40C; Datasheet Version: Rev. 7, 01/2015; Pin Count: 8; Operating Temperature (Max): 125C; Package Description: 8-Pin Small Outline Integrated Circuit, Body 4.9 x 3.9 mm, Pitch 1.27 mm; Category: Transceiver; Packaging: TapeandReel; Mounting: SurfaceMount; Package Reference: SOT96-1; Operating Temperature Classification: Automotive; Mounting Technology: SurfaceMount; Package Type: SO; Manufacturer URL: http://www.nxp.com/; Datasheet URL: http://www.nxp.com/documents/data_sheet/TJA1051.pdf
U2 U3 = CMP-14351-000002-1: IC SHIFT REGISTER 8BIT 16TSSOP; Manufacturer: Nexperia; Nominal Supply Current: 160uA; Max Supply Voltage: 6V; Standoff Height: 0.05mm; Automotive Grade: Grade 1; Number Of Circuits: 1; Min Supply Voltage: 2V; Frequency: 108MHz; Number Of Outputs: 9; Propagation Delay: 16ns; Ambient Temperature Range Low: -40°C; Device Class L3: Shift Registers; Device Class L2: Logic ICs; RoHS: TRUE; Footprint Url: https://assets.nexperia.com/documents/outline-drawing/SOT403-1.pdf; ComponentLink2URL: https://assets.nexperia.com/documents/data-sheet/74HC_HCT595_Q100.pdf; Digikey Description: IC SHIFT REGISTER 8BIT 16TSSOP; Manufacturer Part Number: 74HC595PW-Q100,118; Automotive: Yes; Temperature Range High: +125°C; Temperature Range Low: -40°C; Height: 1.1mm; Ambient Temperature Range High: +125°C; Package: SOT403-1; ComponentLink2Description: Datasheet; Octopart: https://octopart.com/74hc595pw-q100%2C118-nexperia-78737379; Number Of Inputs: 1; Ipc Land Pattern Name: SOP65P500X110-16; Lead Free: Yes; Device Class L1: Integrated Circuits (ICs); Category: IC; Temperature: -40°C to +125°C
Y1 = CMP-27762-000018-1: XTAL OSC XO 8.000MHZ HCMOS TTL; Manufacturer: Abracon; Stability: 50ppm; Min Supply Voltage: 2.97V; Max Supply Voltage: 3.63V; Load Capacitance: 15pF; Max Supply Current: 15mA; Temperature Range Low: -20°C; Temperature Range High: +70°C; Automotive: No; Device Class L3: Oscillators; Height: 1.3mm; Device Class L2: Crystals / Oscillators; Digikey Description: XTAL OSC XO 8.000MHZ HCMOS TTL; Footprint Url: https://abracon.com/Support/PackageDrawing/Oscillators/ASFL1.PDF; Manufacturer Part Number: ASFL1-8.000MHZ-EK-T; ComponentLink2URL: https://abracon.com/Oscillators/ASFL1.pdf; Mouser Description: Oscillator XO 8.000MHz 50ppm 15pF (Stability) HCMOS/TTL 60% 3.3V 4-Pin SMD T/R; Package: ASFL1; Series: ASFL1; Octopart: https://octopart.com/asfl1-16.384mhz-ec-t-abracon-317624; Category: Crys; Lead Free: Yes; RoHS: TRUE; Frequency: 8.000MHz; Temperature: -20°C to +70°C; Device Class L1: Passive Components; ComponentLink2Description: Datasheet

## Sheet Connectors.SchDoc
size A3
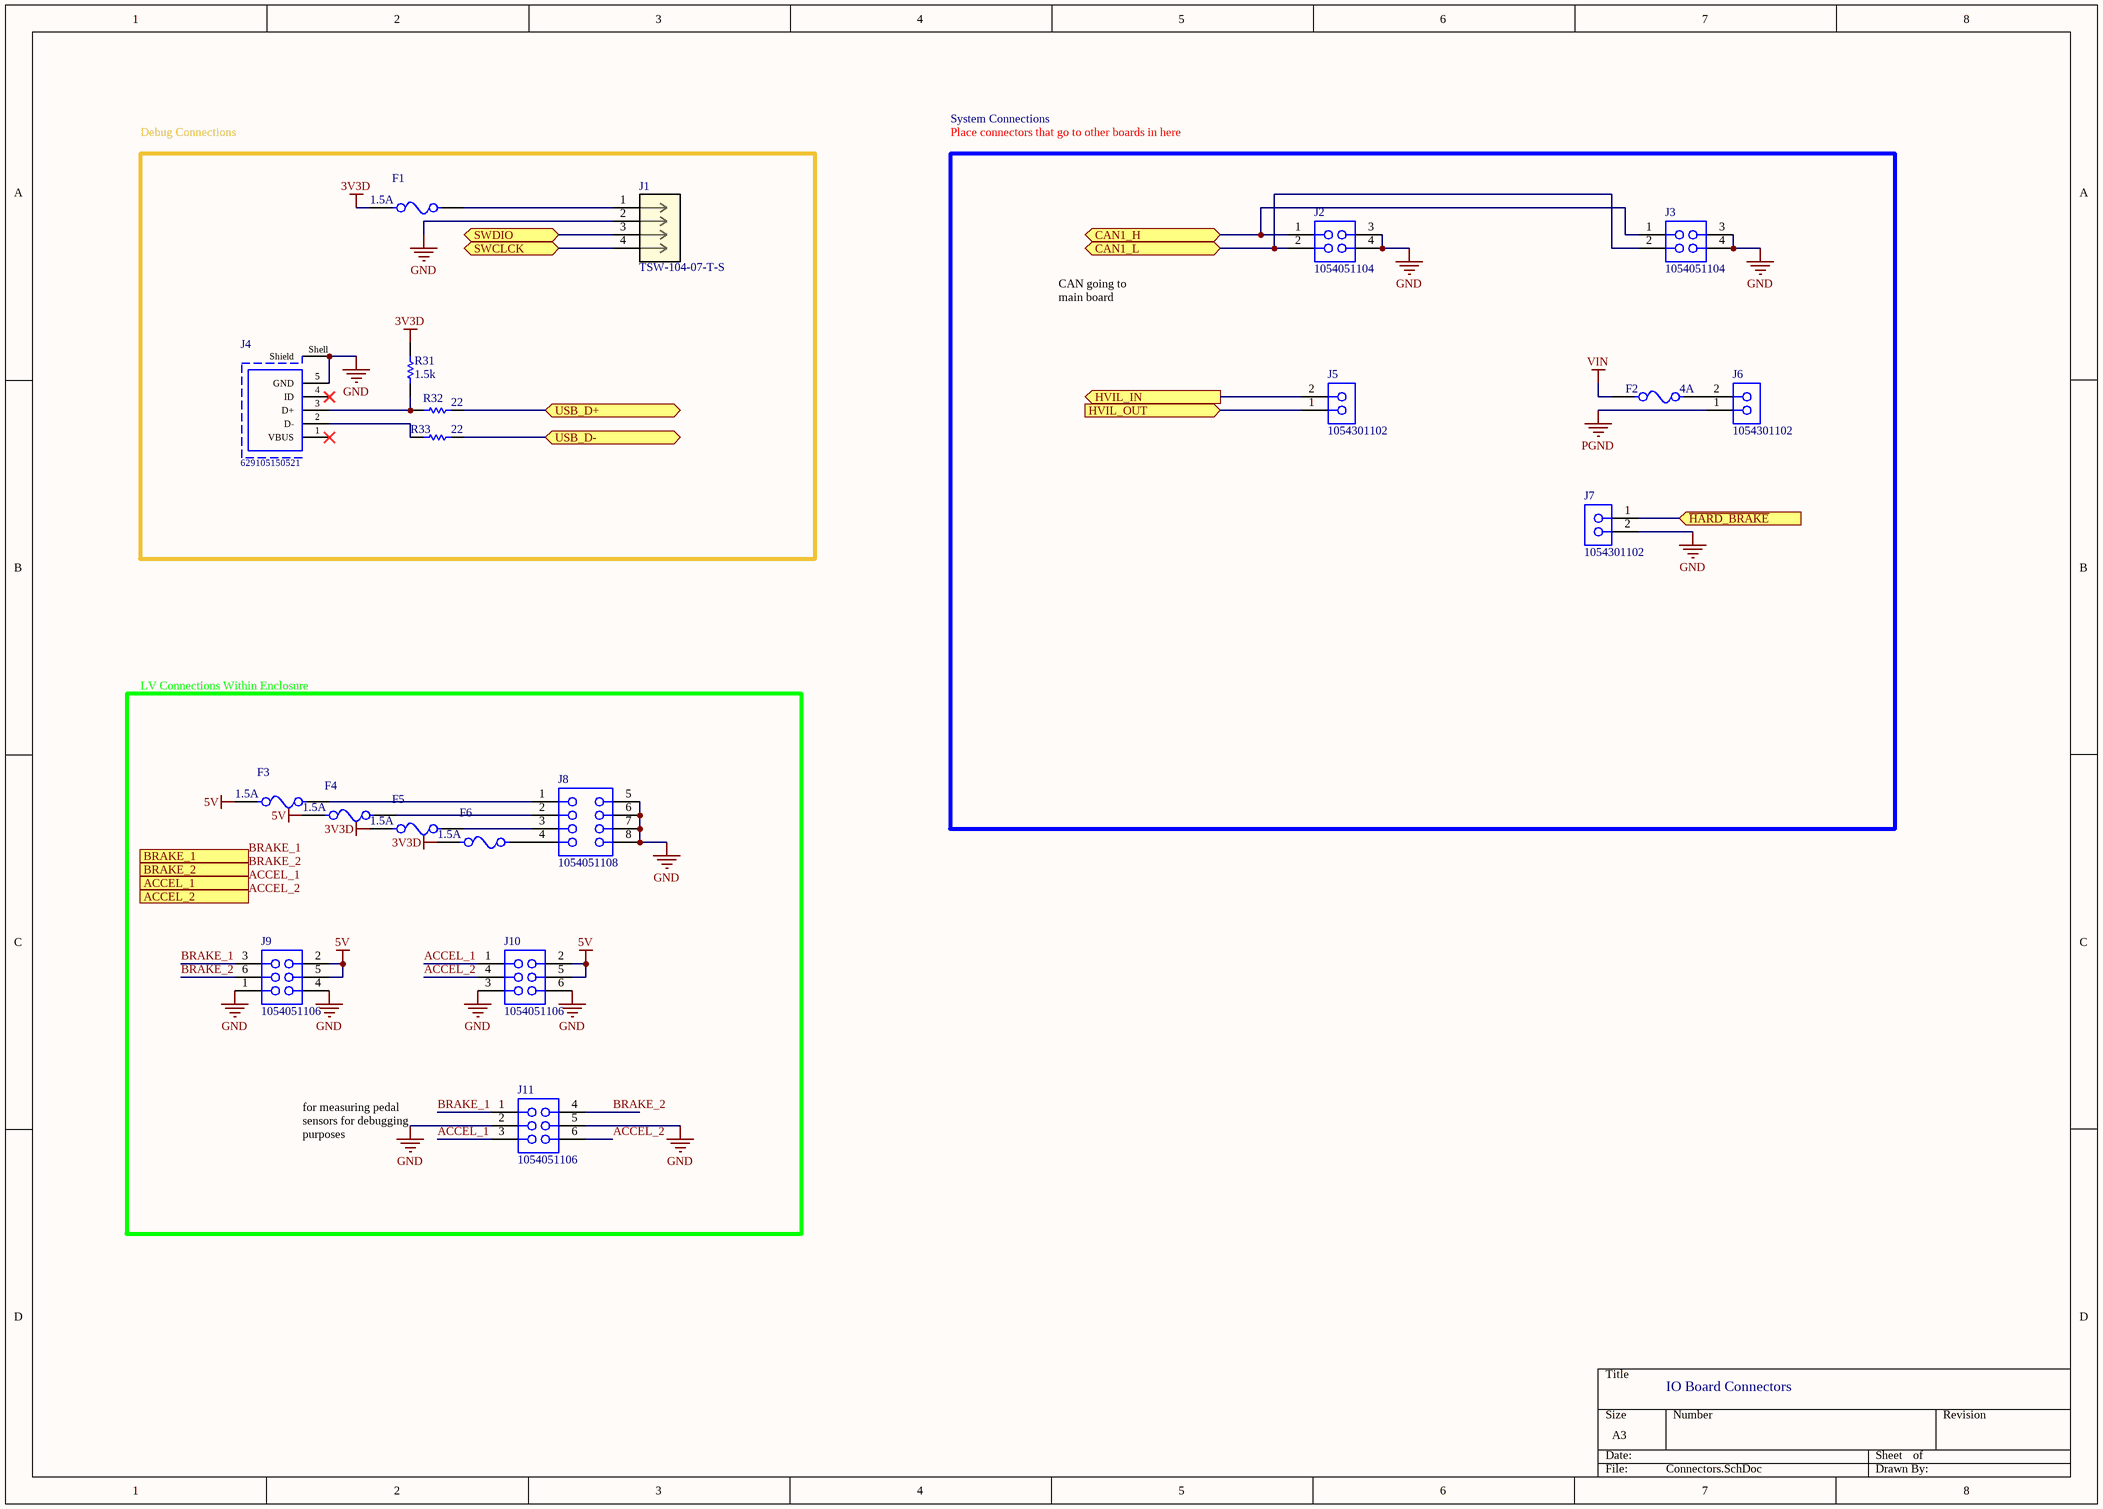
[diagram p2: Connectors.SchDoc]

### Parts
F1  1.5A  [FUSC1608X43N]
F2  4A  [0466004.NR]
F3  1.5A  [FUSC1608X43N]
F4  1.5A  [FUSC1608X43N]
F5  1.5A  [FUSC1608X43N]
F6  1.5A  [FUSC1608X43N]
J1  TSW-104-07-T-S  [CON4_1X4_TU_TSW]
J2  1054051104  [1054051104]
J3  1054051104  [1054051104]
J4  629105150521  [629105150521]
J5  1054301102  [1054301102]
J6  1054301102  [1054301102]
J7  1054301102  [1054301102]
J8  1054051108  [1054051108]
J9  1054051106  [1054051106]
J10  1054051106  [1054051106]
J11  1054051106  [1054051106]
R31  1.5k  [RESC2013X50X35ML15T15]
R32  22  [RESC0805(2012)_L]
R33  22  [RESC2013X50X35ML15T15]

### Blocks framed on the sheet
Debug Connections: F1 J1 J4 R31-R33
Place connectors that go to other boards in here: F2 J2 J3 J5-J7
LV Connections Within Enclosure: F3-F6 J8-J11

### Ports
ACCEL_1 (out), ACCEL_2 (out), BRAKE_1 (out), BRAKE_2 (out), CAN1_H (bidir), CAN1_L (bidir), HVIL_IN (out), HVIL_OUT (in), SWCLCK (bidir), SWDIO (bidir), USB_D+ (bidir), USB_D- (bidir), ~{HARD_BRAKE} (in)

### Nets
3V3D: F1.1 F5.1 F6.1 R31.1
5V: F3.1 F4.1 J9.2 J9.5 J10.2 J10.5
GND: J1.2 J2.3 J2.4 J3.3 J3.4 J4.5(GND) J4.Shell(Shield) J7.2 J8.5 J8.6 J8.7 J8.8 J9.1 J9.4 J10.3 J10.6 J11.2 J11.5
PGND: J6.1
VIN: F2.1
ACCEL_1: J10.1 J11.3 ; port ACCEL_1
ACCEL_2: J10.4 J11.6 ; port ACCEL_2
BRAKE_1: J9.3 J11.1 ; port BRAKE_1
BRAKE_2: J9.6 J11.4 ; port BRAKE_2
CAN1_N: J2.2 J3.2 ; port CAN1_L
CAN1_P: J2.1 J3.1 ; port CAN1_H
NetF1_2: F1.2 J1.1
NetF2_2: F2.2 J6.2
NetF3_2: F3.2 J8.1
NetF4_2: F4.2 J8.2
NetF5_2: F5.2 J8.3
NetF6_2: F6.2 J8.4
NetIC1_72: J7.1 ; port ~{HARD_BRAKE}
NetIC1_73: R33.1 ; port USB_D-
NetIC1_74: R32.1 ; port USB_D+
NetIC1_75: J1.3 ; port SWDIO
NetIC1_79: J1.4 ; port SWCLCK
NetJ4_2: J4.2(D-) R33.2
NetJ4_3: J4.3(D+) R31.2 R32.2
NetJ5_1: J5.1 ; port HVIL_OUT
NetJ5_2: J5.2 ; port HVIL_IN

Not connected (* = marked no-connect by the designer): J4 1(VBUS)* 4(ID)*

### Notes on the sheet
- System Connections
- CAN going to main board
- for measuring pedal sensors for debugging purposes
- IO Board Connectors

### Library data of the parts
F1 F3-F6 = 046701.5NR: 1.5A 0603 Fuse; Manufacturer_Name: LITTELFUSE; Datasheet Link: https://www.littelfuse.com/~/media/electronics/datasheets/fuses/littelfuse_fuse_467_datasheet.pdf.pdf; Height: 0.432mm; Manufacturer_Part_Number: 046701.5NR; Arrow Part Number: 046701.5NR; Arrow Price/Stock: https://www.arrow.com/en/products/046701.5nr/littelfuse; Mouser Part Number: 576-046701.5NR; Mouser Price/Stock: https://www.mouser.com/Search/Refine.aspx?Keyword=576-046701.5NR; Value: 1.5A
F2 = 0466004.NR: FUSE BOARD MNT 4A 32VAC/VDC 1206; Manufacturer: Littelfuse; DC Cold Resistance: 14mR; Voltage Rating (AC): 32V; Fuse Type: Board Mount (Cartridge Style Excluded); Approvals: UL,CSA; Supplier 1: Digi-Key; Manufacturer Part Number: 0466004.NR; RoHS: Yes; Category: Fuses; Stock 1: 7288; Pricing 1: 1=0.85000, 5=0.82000, 10=0.76800, 50=0.63520, 100=0.52930, 250=0.51608, 500=0.43668, 1000=0.38376 (USD); Mount: Surface Mount; Case/Package: 1206; Case Code (Imperial): 1206; Case Code (Metric): 3216; Min Operating Temperature: -55°C; Max Operating Temperature: 90°C; Voltage Rating (DC): 32V; Current Rating: 4A; Packaging: Tape and Reel; Resistance: 14mR; Package Quantity: 5000; Fuse Current: 4A; Voltage Rating: 32V; Length: 3.18mm; Height: 0.023inch; Depth: 1.52mm; Width: 1.52mm; Lead Free: Lead Free; REACH SVHC: Unknown; ComponentLink1URL: https://datasheet.ciiva.com/16200/littelfuse-fuse-466-16200179.pdf?src-supplier=Future+Electronics; ComponentLink1Description: https://datasheet.ciiva.com/16200/littelfuse-fuse-466-16200179.pdf?src-supplier=Future+Electronics; ComponentLink2URL: https://datasheet.ciiva.com/1549/48294-1549713.pdf?src-supplier=Element14; ComponentLink2Description: https://datasheet.ciiva.com/1549/48294-1549713.pdf?src-supplier=Element14; ComponentLink3URL: https://datasheet.ciiva.com/7991/littelfuse-fuse-466-7991928.pdf?src-supplier=Element14; ComponentLink3Description: https://datasheet.ciiva.com/7991/littelfuse-fuse-466-7991928.pdf?src-supplier=Element14; ComponentLink4URL: https://datasheet.ciiva.com/46394/728615-46394826.pdf?src-supplier=Element14; ComponentLink4Description: https://datasheet.ciiva.com/46394/728615-46394826.pdf?src-supplier=Element14; ComponentLink5URL: https://datasheet.ciiva.com/22713/48294-22713051.pdf?src-supplier=Element14; ComponentLink5Description: https://datasheet.ciiva.com/22713/48294-22713051.pdf?src-supplier=Element14; ComponentLink6URL: https://datasheet.ciiva.com/301/466seriesdrawing-301660.pdf?src-supplier=Digi-Key; ComponentLink6Description: https://datasheet.ciiva.com/301/466seriesdrawing-301660.pdf?src-supplier=Digi-Key; ComponentLink7URL: https://datasheet.ciiva.com/301/466seriesdrawing-301661.pdf?src-supplier=Digi-Key; ComponentLink7Description: https://datasheet.ciiva.com/301/466seriesdrawing-301661.pdf?src-supplier=Digi-Key; ComponentLink8URL: https://datasheet.ciiva.com/301/466seriesdrawing-301662.pdf?src-supplier=Digi-Key; ComponentLink8Description: https://datasheet.ciiva.com/301/466seriesdrawing-301662.pdf?src-supplier=Digi-Key; Supplier Part Number 1: F1459CT-ND; Value: 4A
J1 = TSW-104-07-T-S: 4 Pin Header; Vendor: Samtec Inc; Built_By: EMA_UL_Team; Manufacturer_Part_Number: TSW-104-07-T-S; Copyright: Copyright (C) 2018 Accelerated Designs. All rights reserved; RefDes: RefDes; Type: DEV
J2 J3 = 1054051104: Nano-Fit Right-Angle Header, Surface Mount, 2.50mm Pitch, Dual Row, 4 Circuits, 0.76µm Tin (Sn) Plating, Black, Glow-Wire Capable; Manufacturer: Molex; Pitch: 2.5 mm; Part Number: 1054051104; ComponentLink2Description: Datasheet; Mounting Technology: Surface Mount; ComponentLink2URL: https://www.molex.com/webdocs/datasheets/pdf/en-us/1054051104_PCB_HEADERS.pdf; Orientation: Right
J4 = CMP-1502-03252-1: Micro USB 2.0 Type B Receptacle WR-COM, Horizontal, SMT, with Pegs, High Current at Pin 1 & Pin 5; Manufacturer: Wurth Elektronik; Contact Resistance: 30mOhm; Rated Current: 3A; Working Voltage: 30VAC; Package Reference: 629105150521; Mounting Technology: SMT; Connector Type: MicroUSB2.0TypeB; Operating Temperature: -40to85degC; Orientation: Horizontal; Manufacturer URL: http://www.we-online.de; Datasheet URL: https://katalog.we-online.de/em/datasheet/629105150521.pdf; Part Number: 629105150521; Packaging: TapeandReel; Gender: Receptacle; Publisher: WurthElektronik
J5-J7 = 1054301102: Nano-Fit Right-Angle Header, Surface Mount, 2.50mm Pitch, Single Row, 2 Circuits, 0.76µm Tin (Sn) Plating, Black, Glow-Wire Capable; Manufacturer: Molex; Pitch: 2.5 mm; Part Number: 1054301102; ComponentLink2Description: Datasheet; Mounting Technology: Surface Mount; ComponentLink2URL: https://www.molex.com/webdocs/datasheets/pdf/en-us/1054301102_PCB_HEADERS.pdf; Orientation: Right
J8 = 1054051108: Nano-Fit Right-Angle Header, Surface Mount, 2.50mm Pitch, Dual Row, 8 Circuits, 0.76µm Tin (Sn) Plating, Black, Glow-Wire Capable; Manufacturer: Molex; Part Number: 1053141108; Pitch: 2.5mm; ComponentLink2URL: https://www.molex.com/webdocs/datasheets/pdf/en-us/1054051108_PCB_HEADERS.pdf; ComponentLink2Description: Datasheet; Orientation: Right; Mounting Technology: Surface Mount
J9-J11 = 1054051106: Nano-Fit Right-Angle Header, Surface Mount, 2.50mm Pitch, Dual Row, 6 Circuits, 0.76µm Tin (Sn) Plating, Black, Glow-Wire Capable; Manufacturer: Molex; Pitch: 2.5 mm; Part Number: 1054051106; ComponentLink2Description: Datasheet; Mounting Technology: Surface Mount; ComponentLink2URL: https://www.molex.com/webdocs/datasheets/pdf/en-us/1054051106_PCB_HEADERS.pdf; Orientation: Right
R31 = CMP-009-00001-4: Chip Resistor,1.5k Ohm, +/- 1%, 125 mW, -55 to 155 degC, 0805 (2012 Metric); Power: 125mW; Voltage Rating: 150V; Tolerance: 1%; Mounting Technology: SM; Value: 1.5k; Min Operating Temperature: -55°C; Case/Package: 0805; Pins: 2; Max Operating Temperature: 155°C; RoHS Compliant: True
R32 = CMP-1013-00736-1: 100K 0.125W 1% 0805 (2012 Metric)  SMD; Case-Metric: 2012; Case-EIA: 0805; Value: 22; Tolerance: 1 %; Technology: SMT; Power: 0.125 W
R33 = CMP-009-00001-4: Chip Resistor, 22 Ohm, +/- 1%, 125 mW, -55 to 155 degC, 0805 (2012 Metric); Power: 125mW; Voltage Rating: 150V; Tolerance: 1%; Mounting Technology: SM; Value: 22; Min Operating Temperature: -55°C; Case/Package: 0805; Pins: 2; Max Operating Temperature: 155°C; RoHS Compliant: True